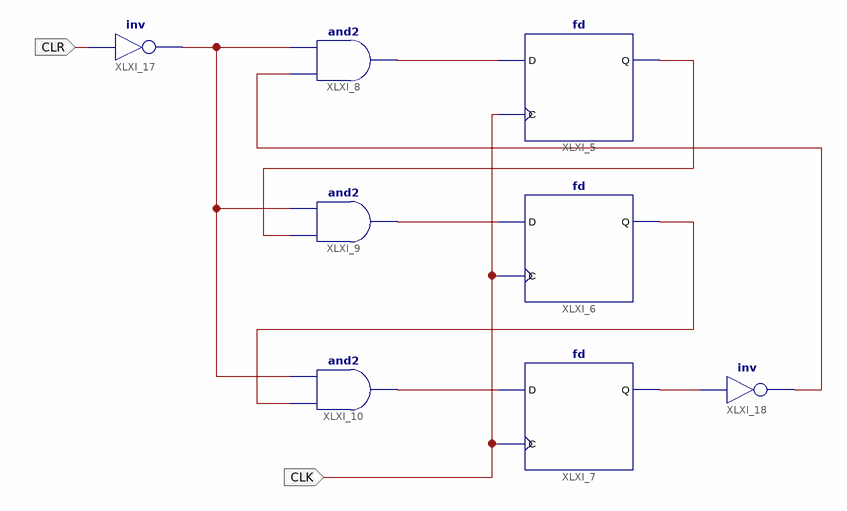
[diagram p0: schematic sheet 1]
// Xilinx ISE schematic C4_29.sch (kintex7) as structural Verilog: 8 symbols, 2 ports
module C4_29 (
  input  CLK,
  input  CLR
);

  wire XLXN_10, XLXN_15, XLXN_16, XLXN_17, XLXN_18, XLXN_19, XLXN_20, XLXN_21;

  not XLXI_18 (XLXN_21, XLXN_20);
  not XLXI_17 (XLXN_10, CLR);
  and XLXI_10 (XLXN_17, XLXN_19, XLXN_10);
  and XLXI_9 (XLXN_16, XLXN_18, XLXN_10);
  and XLXI_8 (XLXN_15, XLXN_21, XLXN_10);
  fd XLXI_7 (.C(CLK), .D(XLXN_17), .Q(XLXN_20));
  fd XLXI_6 (.C(CLK), .D(XLXN_16), .Q(XLXN_19));
  fd XLXI_5 (.C(CLK), .D(XLXN_15), .Q(XLXN_18));
endmodule
